# EAGLE design 555module (EAGLE 5.11)
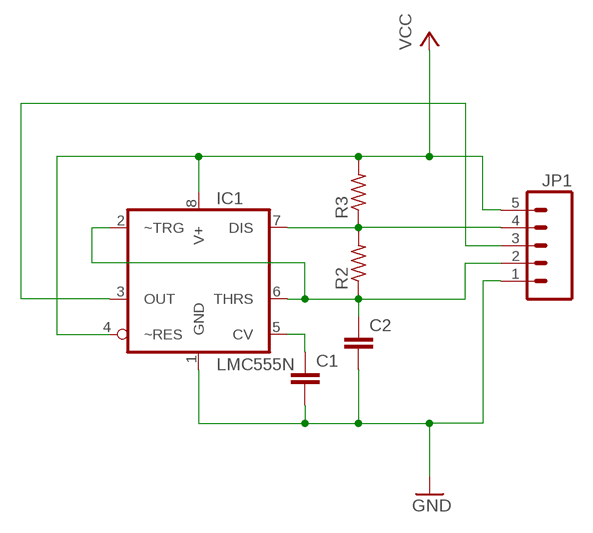
[diagram p0: schematic, sheet 1]

## Parts
C1  C2.5/2  [C2.5-2]
C2  C2.5/2  [C2.5-2]
IC1  LMC555N  [DIL08]
JP1  M05PTH_LONGPADS  [1X05_LONGPADS]
R2  R-US_0204/5  [0204/5]
R3  R-US_0204/5  [0204/5]

## Nets
GND: C1.2 C2.2 IC1.1(GND) JP1.1
N$1: IC1.7(DIS) JP1.4 R2.2 R3.1
N$2: IC1.3(OUT) JP1.3
N$3: C2.1 IC1.2(~TRG) IC1.6(THRS) JP1.2 R2.1
N$5: C1.1 IC1.5(CV)
VCC: IC1.4(~RES) IC1.8(V+) JP1.5 R3.2

## Library data of the parts
C1 C2 = capacitor-wima:C: CAPACITOR naming: grid - package width
IC1 = My Library:LMC555: CMOS TIMER
JP1 = SparkFun:M05: Header 5 Standard 5-pin 0.1" header. Use with straight break away headers (SKU : PRT-00116), right angle break away headers (PRT-00553), swiss pins (PRT-00743), machine pins (PRT-00117), and female headers (PRT-00115). Molex polarized connector foot print use with SKU : PRT-08230 with associated crimp pins and housings.
R2 R3 = adafruit:R-US_: RESISTOR, American symbol

## Board
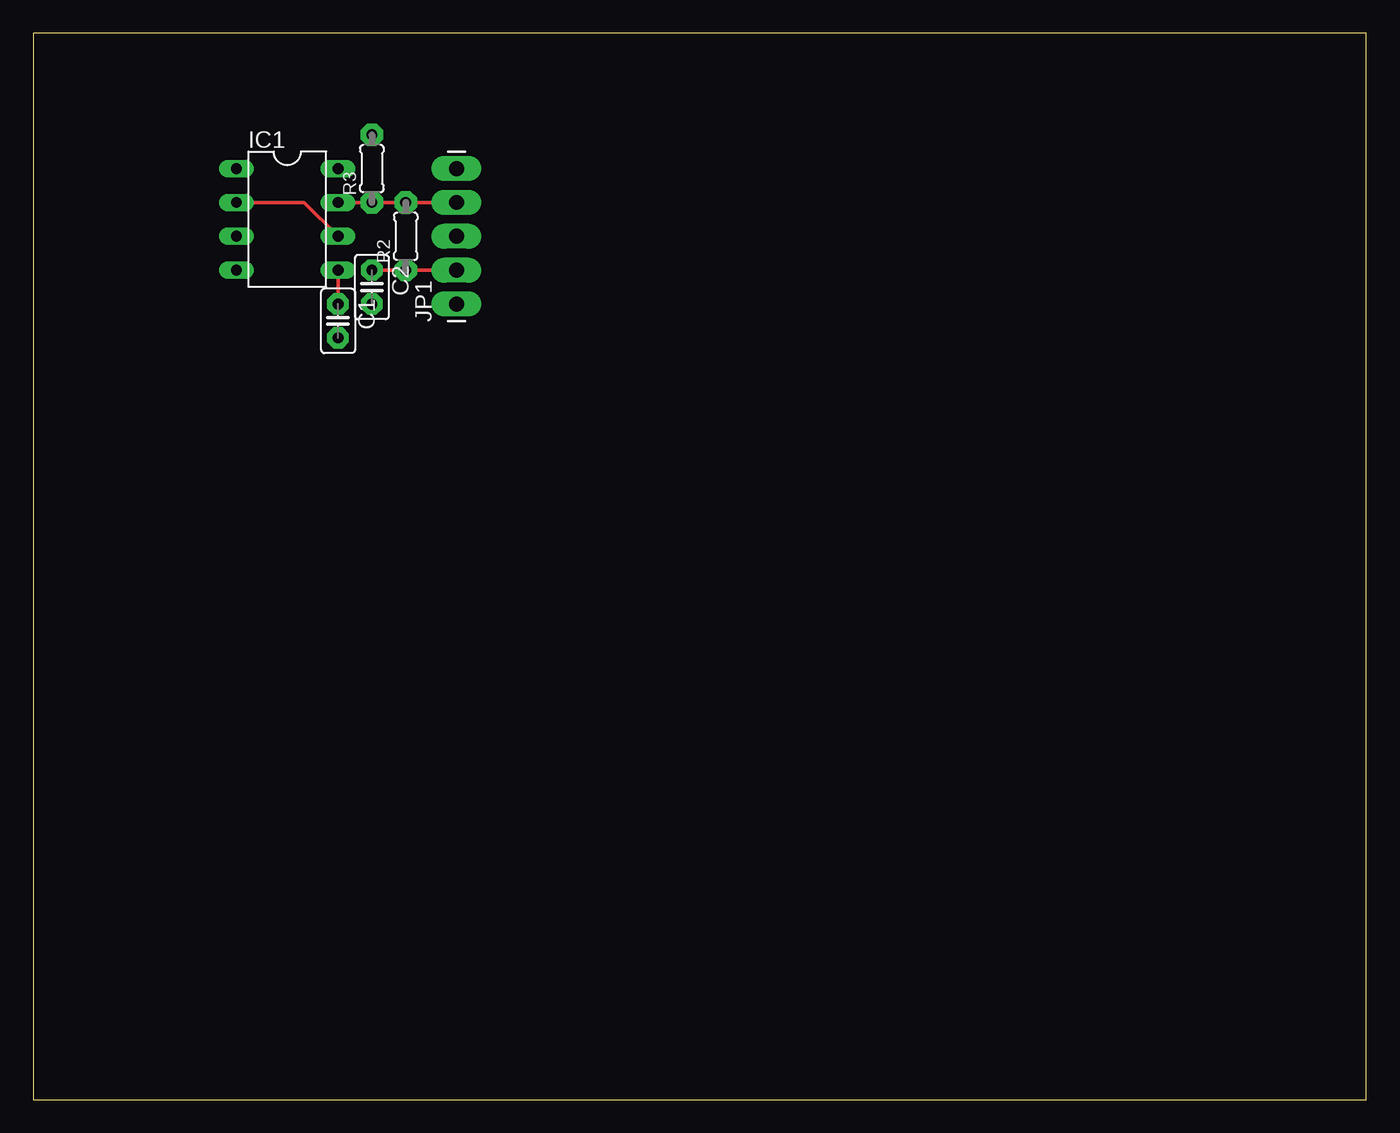
[diagram p1: board, top side]
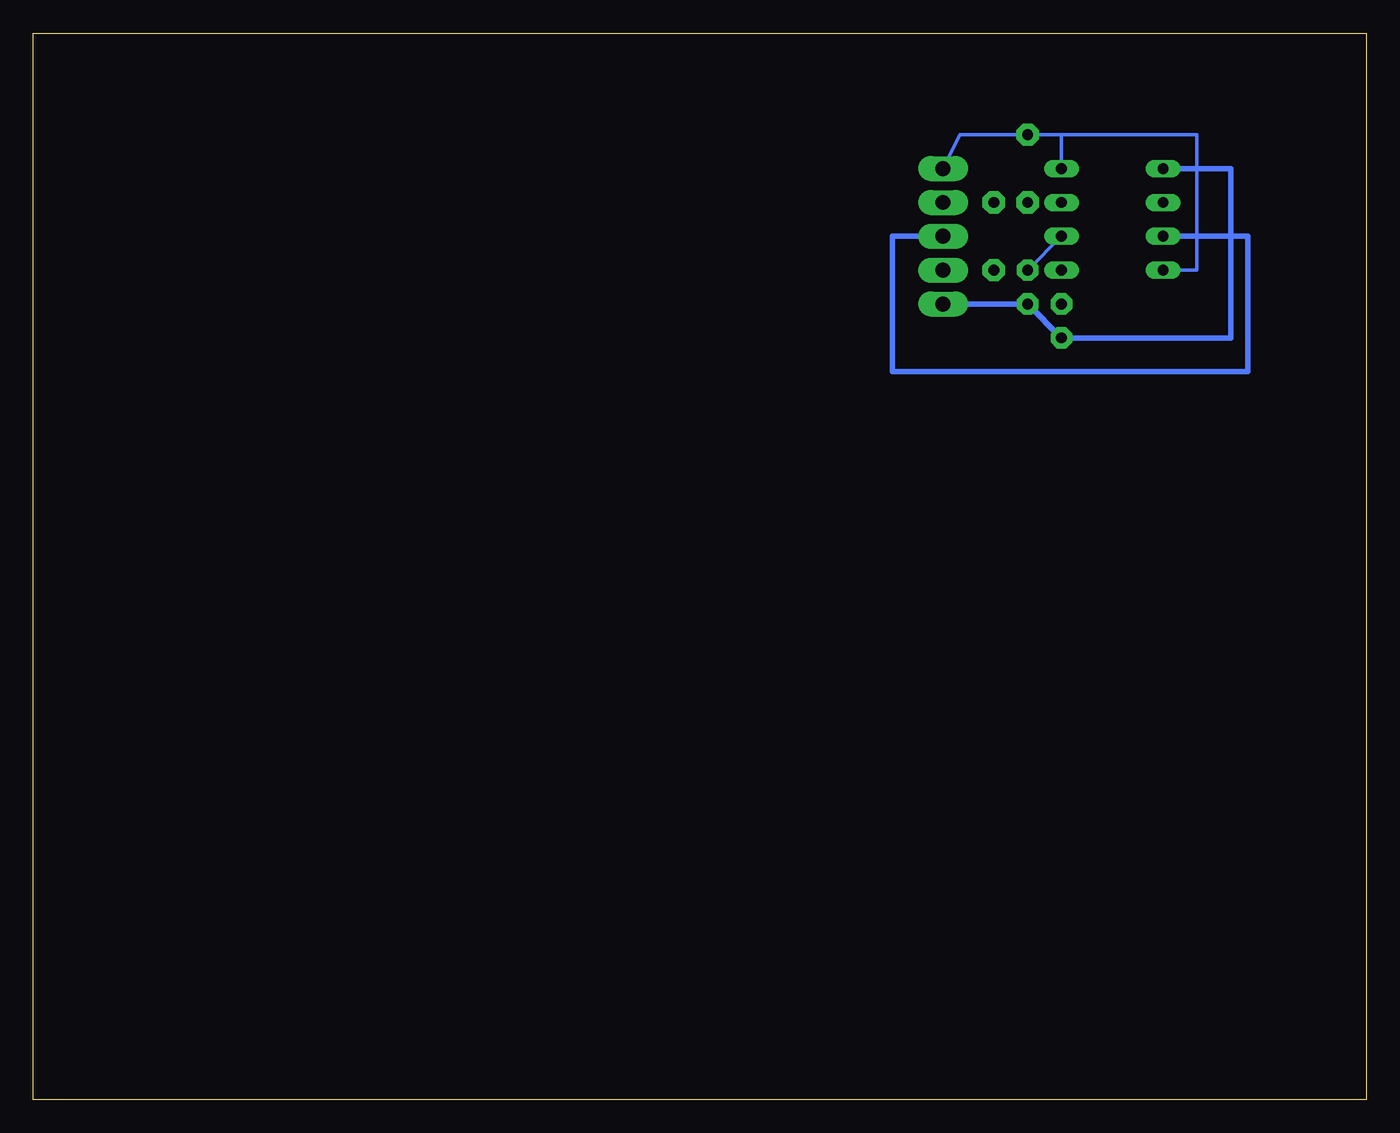
[diagram p2: board, bottom side, seen from below]

Size 100 x 80 mm. Coordinates in mm from the lower left corner, seen from the top.
Outline: 0,0 100,0 100,80 0,80 0,0
Copper layers (1*16): Top 0.035mm / dielectric 1.5mm / Bottom 0.035mm
Design rules "default": minimum track width 10mil, minimum drill 24mil, track to track 8mil, track to pad 8mil, pad to pad 8mil, via to via 8mil, smd to smd 8mil, copper to edge 40mil, drill to drill 8mil, minimum pad ring 10mil, minimum via ring 8mil, stop-mask expansion 4mil, vias tented up to drill 0mil, thermal gap 10mil

### Footprints (pad centres in the part's own frame; a part is rotated, then mirrored left to right if it is on the bottom)
C2.5-2 = drill 0.813 pad 1.6 octagon: 1 -1.27,0; 2 1.27,0
DIL08 = drill 0.813 long: 1 -3.81,-3.81; 2 -1.27,-3.81; 3 1.27,-3.81; 4 3.81,-3.81; 5 3.81,3.81; 6 1.27,3.81; 7 -1.27,3.81; 8 -3.81,3.81
1X05_LONGPADS = drill 1.118 pad 1.88 long: 1 0,0; 2 2.54,0; 3 5.08,0; 4 7.62,0; 5 10.16,0
0204/5 = drill 0.813 pad 1.676 octagon: 1 -2.54,0; 2 2.54,0

### Placement (x,y rotation side)
C1  22.86,58.42 270 top
C2  25.4,60.96 270 top
IC1  19.05,66.04 270 top
JP1  31.75,59.69 90 top
R2  27.94,64.77 90 top
R3  25.4,69.85 90 top

### Tracks (layer width: path | path; a pad name or v marks a point on that pad's centre or on a via)
GND
  Bottom 0.406: IC1.1 10.16,69.85 10.16,57.15 C1.2 C2.2 JP1.1
N$1
  Top 0.254: IC1.7 R3.1 R2.2 JP1.4
N$2
  Bottom 0.406: IC1.3 8.89,64.77 8.89,54.61 35.56,54.61 35.56,64.77 JP1.3
N$3
  Top 0.254: IC1.2 20.32,67.31 IC1.6 | C2.1 R2.1 JP1.2
  Bottom 0.254: IC1.6 C2.1
N$5
  Top 0.254: C1.1 IC1.5
VCC
  Bottom 0.254: IC1.4 12.7,62.23 12.7,72.39 22.86,72.39 | 22.86,72.39 IC1.8 22.86,72.39 | 22.86,72.39 R3.2 30.48,72.39 JP1.5